# EAGLE schematic untitled (EAGLE 6.6.0)

## Sheet 1 of 2
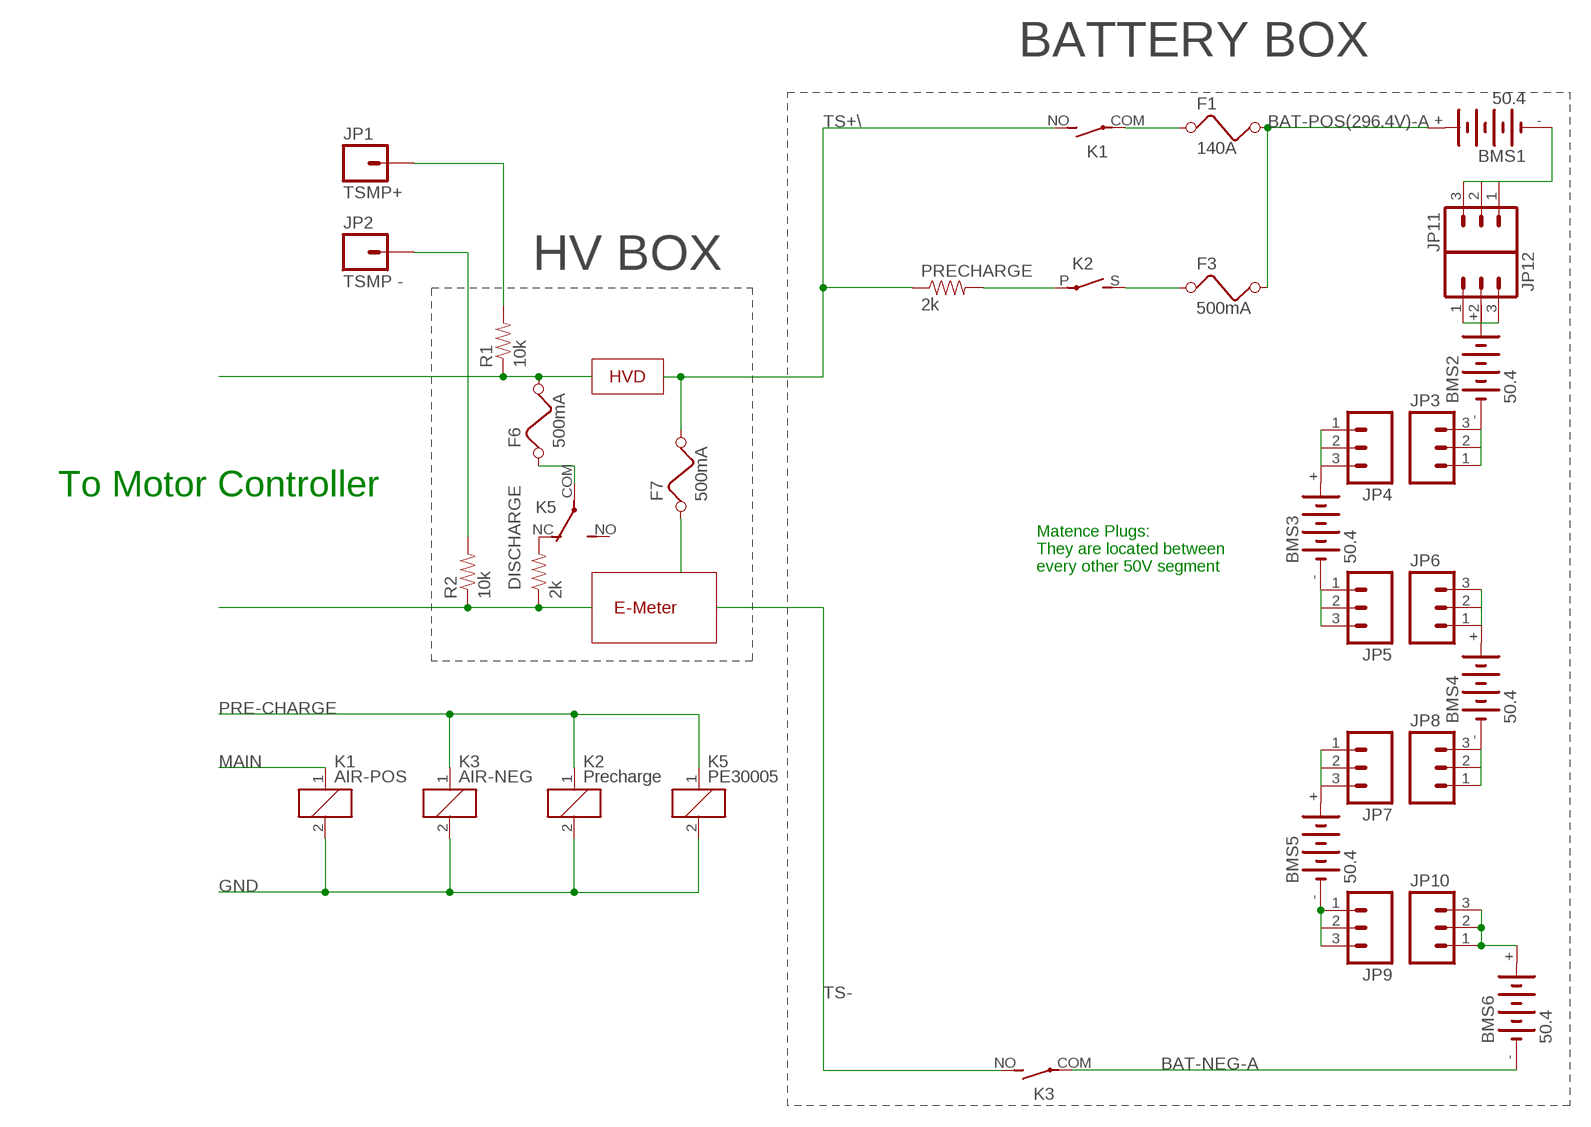
[diagram p0: schematic, sheet 1]

### Parts
BMS1  50.4  VST4V8  [VST4]
BMS2  50.4  VST4V8  [VST4]
BMS3  50.4  VST4V8  [VST4]
BMS4  50.4  VST4V8  [VST4]
BMS5  50.4  VST4V8  [VST4]
BMS6  50.4  VST4V8  [VST4]
DISCHARGE  2k  2.0KOHM1/10W5%(0603)  [0603-RES]
F1  140A  FUSE  [FUSE]
F3  500mA  FUSE  [FUSE]
F6  500mA  FUSE  [FUSE]
F7  500mA  FUSE  [FUSE]
JP1  TSMP+  M01-SMTSO-256-ET  [SMTSO-256-ET]
JP2  TSMP -  M01-SMTSO-256-ET  [SMTSO-256-ET]
JP3  M03JST-PTH  [JST-3-PTH]
JP4  M03JST-PTH  [JST-3-PTH]
JP5  M03JST-PTH  [JST-3-PTH]
JP6  M03JST-PTH  [JST-3-PTH]
JP7  M03JST-PTH  [JST-3-PTH]
JP8  M03JST-PTH  [JST-3-PTH]
JP9  M03JST-PTH  [JST-3-PTH]
JP10  M03JST-PTH  [JST-3-PTH]
JP11  M03JST-PTH  [JST-3-PTH]
JP12  M03JST-PTH  [JST-3-PTH]
K1  AIR-POS  APF30212A  [APF30212A]
K2  Precharge  G2RA  [G2RA]
K3  AIR-NEG  APF30212A  [APF30212A]
K5  PE30005  [PE-FORM-C]
PRECHARGE  2k  2.0KOHM1/10W5%(0603)  [0603-RES]
R1  10k  RESISTOR0805-RES  [0805]
R2  10k  RESISTOR0805-RES  [0805]

### Nets
BAT-NEG-A: BMS6.- K3.COM(2:P)
BAT-POS(296.4V)-A: BMS1.+ F1.2 F3.2
GND: K1.2 K2.2 K3.2 K5.2
MAIN: K1.1
N$1: BMS5.- JP9.1 JP9.2 JP9.3
N$2: BMS6.+ JP10.1 JP10.2 JP10.3
N$3: BMS5.+ JP7.1 JP7.2 JP7.3
N$4: BMS4.- JP8.1 JP8.2 JP8.3
N$5: BMS4.+ JP6.1 JP6.2 JP6.3
N$6: F3.1 K2.S(2:S)
N$7: JP1.P$1 R1.2
N$8: DISCHARGE.2 K5.NC(2:O)
N$9: K2.P(2:P) PRECHARGE.2
N$10: F6.1 K5.COM(2:P)
N$14: F6.2 R1.1
N$15: BMS3.- JP5.1 JP5.2 JP5.3
N$16: JP2.P$1 R2.2
N$17: F7.1
N$19: F1.1 K1.COM(2:P)
N$20: BMS3.+ JP4.1 JP4.2 JP4.3
N$21: BMS2.- JP3.1 JP3.2 JP3.3
N$30: BMS2.+@1(+) JP12.1 JP12.2 JP12.3
N$31: BMS1.- JP11.1 JP11.2 JP11.3
N$113: DISCHARGE.1 R2.1
PRE-CHARGE: K2.1 K3.1 K5.1
TS+\: F7.2 K1.NO(2:S) PRECHARGE.1
TS-: K3.NO(2:S)
Unconnected: BMS1.+@1(+) BMS2.+ BMS3.+@1(+) BMS4.+@1(+) BMS5.+@1(+) BMS6.+@1(+) K5.NO(2:S)

### Notes on the sheet
- BATTERY BOX
- HV BOX
- HVD
- To Motor Controller
- Matence Plugs:
  They are located between
  every other 50V segment
- E-Meter

## Sheet 2 of 2
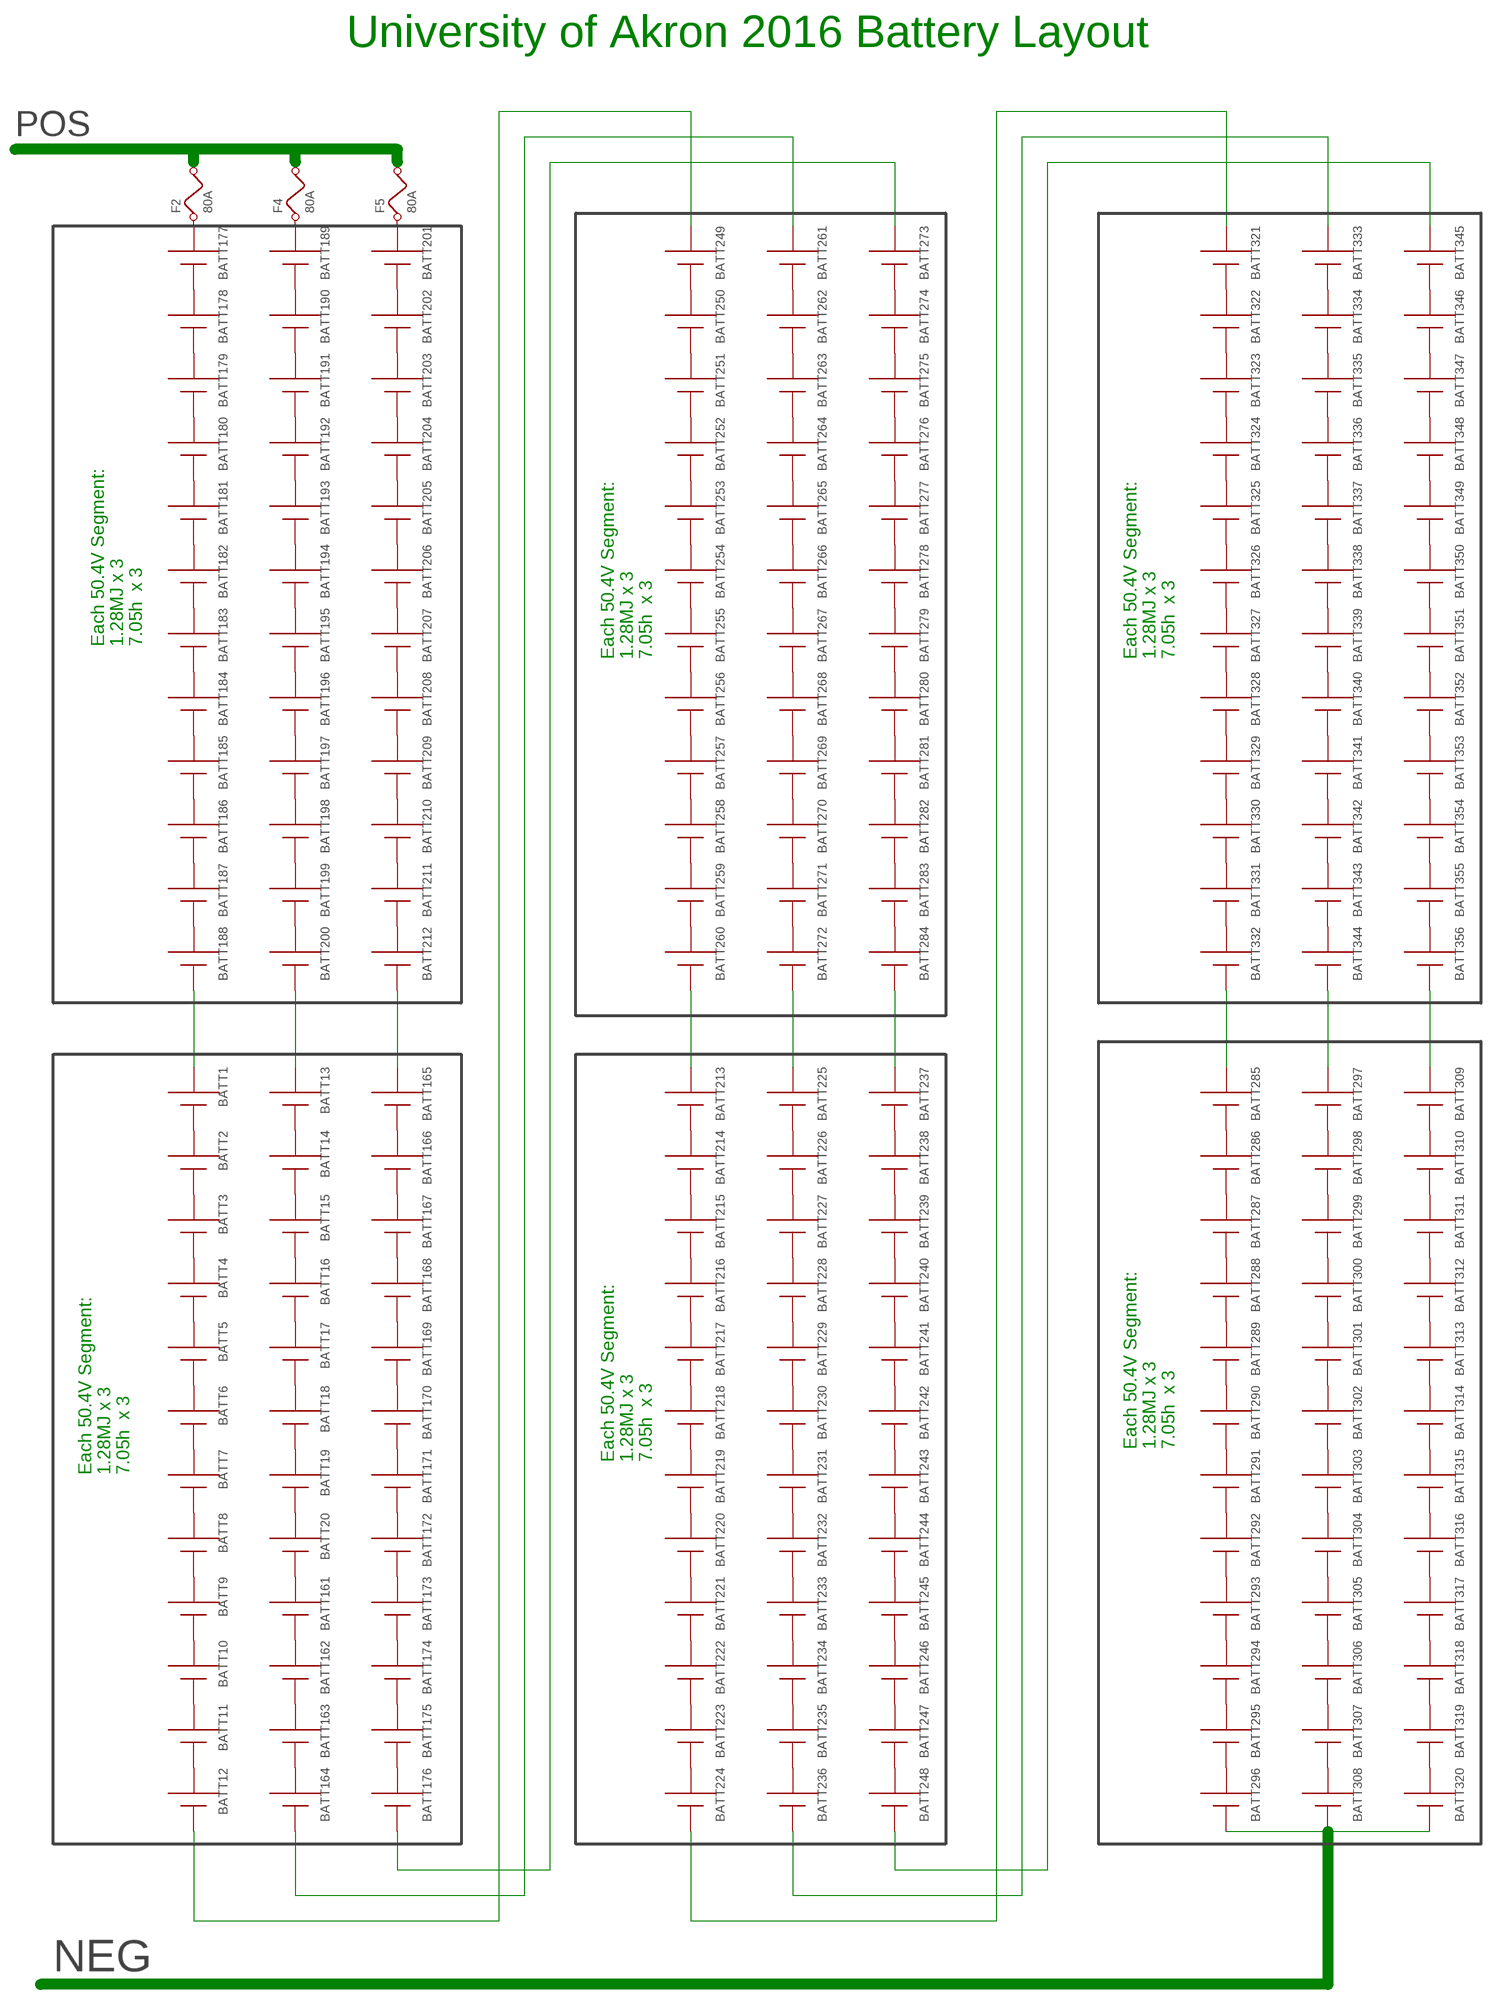
[diagram p1: schematic, sheet 2]

### Parts
BATT1  AAA  [12BH412]
BATT2  AAA  [12BH412]
BATT3  AAA  [12BH412]
BATT4  AAA  [12BH412]
BATT5  AAA  [12BH412]
BATT6  AAA  [12BH412]
BATT7  AAA  [12BH412]
BATT8  AAA  [12BH412]
BATT9  AAA  [12BH412]
BATT10  AAA  [12BH412]
BATT11  AAA  [12BH412]
BATT12  AAA  [12BH412]
BATT13  AAA  [12BH412]
BATT14  AAA  [12BH412]
BATT15  AAA  [12BH412]
BATT16  AAA  [12BH412]
BATT17  AAA  [12BH412]
BATT18  AAA  [12BH412]
BATT19  AAA  [12BH412]
BATT20  AAA  [12BH412]
BATT161  AAA  [12BH412]
BATT162  AAA  [12BH412]
BATT163  AAA  [12BH412]
BATT164  AAA  [12BH412]
BATT165  AAA  [12BH412]
BATT166  AAA  [12BH412]
BATT167  AAA  [12BH412]
BATT168  AAA  [12BH412]
BATT169  AAA  [12BH412]
BATT170  AAA  [12BH412]
BATT171  AAA  [12BH412]
BATT172  AAA  [12BH412]
BATT173  AAA  [12BH412]
BATT174  AAA  [12BH412]
BATT175  AAA  [12BH412]
BATT176  AAA  [12BH412]
BATT177  AAA  [12BH412]
BATT178  AAA  [12BH412]
BATT179  AAA  [12BH412]
BATT180  AAA  [12BH412]
BATT181  AAA  [12BH412]
BATT182  AAA  [12BH412]
BATT183  AAA  [12BH412]
BATT184  AAA  [12BH412]
BATT185  AAA  [12BH412]
BATT186  AAA  [12BH412]
BATT187  AAA  [12BH412]
BATT188  AAA  [12BH412]
BATT189  AAA  [12BH412]
BATT190  AAA  [12BH412]
BATT191  AAA  [12BH412]
BATT192  AAA  [12BH412]
BATT193  AAA  [12BH412]
BATT194  AAA  [12BH412]
BATT195  AAA  [12BH412]
BATT196  AAA  [12BH412]
BATT197  AAA  [12BH412]
BATT198  AAA  [12BH412]
BATT199  AAA  [12BH412]
BATT200  AAA  [12BH412]
BATT201  AAA  [12BH412]
BATT202  AAA  [12BH412]
BATT203  AAA  [12BH412]
BATT204  AAA  [12BH412]
BATT205  AAA  [12BH412]
BATT206  AAA  [12BH412]
BATT207  AAA  [12BH412]
BATT208  AAA  [12BH412]
BATT209  AAA  [12BH412]
BATT210  AAA  [12BH412]
BATT211  AAA  [12BH412]
BATT212  AAA  [12BH412]
BATT213  AAA  [12BH412]
BATT214  AAA  [12BH412]
BATT215  AAA  [12BH412]
BATT216  AAA  [12BH412]
BATT217  AAA  [12BH412]
BATT218  AAA  [12BH412]
BATT219  AAA  [12BH412]
BATT220  AAA  [12BH412]
BATT221  AAA  [12BH412]
BATT222  AAA  [12BH412]
BATT223  AAA  [12BH412]
BATT224  AAA  [12BH412]
BATT225  AAA  [12BH412]
BATT226  AAA  [12BH412]
BATT227  AAA  [12BH412]
BATT228  AAA  [12BH412]
BATT229  AAA  [12BH412]
BATT230  AAA  [12BH412]
BATT231  AAA  [12BH412]
BATT232  AAA  [12BH412]
BATT233  AAA  [12BH412]
BATT234  AAA  [12BH412]
BATT235  AAA  [12BH412]
BATT236  AAA  [12BH412]
BATT237  AAA  [12BH412]
BATT238  AAA  [12BH412]
BATT239  AAA  [12BH412]
BATT240  AAA  [12BH412]
BATT241  AAA  [12BH412]
BATT242  AAA  [12BH412]
BATT243  AAA  [12BH412]
BATT244  AAA  [12BH412]
BATT245  AAA  [12BH412]
BATT246  AAA  [12BH412]
BATT247  AAA  [12BH412]
BATT248  AAA  [12BH412]
BATT249  AAA  [12BH412]
BATT250  AAA  [12BH412]
BATT251  AAA  [12BH412]
BATT252  AAA  [12BH412]
BATT253  AAA  [12BH412]
BATT254  AAA  [12BH412]
BATT255  AAA  [12BH412]
BATT256  AAA  [12BH412]
BATT257  AAA  [12BH412]
BATT258  AAA  [12BH412]
BATT259  AAA  [12BH412]
BATT260  AAA  [12BH412]
BATT261  AAA  [12BH412]
BATT262  AAA  [12BH412]
BATT263  AAA  [12BH412]
BATT264  AAA  [12BH412]
BATT265  AAA  [12BH412]
BATT266  AAA  [12BH412]
BATT267  AAA  [12BH412]
BATT268  AAA  [12BH412]
BATT269  AAA  [12BH412]
BATT270  AAA  [12BH412]
BATT271  AAA  [12BH412]
BATT272  AAA  [12BH412]
BATT273  AAA  [12BH412]
BATT274  AAA  [12BH412]
BATT275  AAA  [12BH412]
BATT276  AAA  [12BH412]
BATT277  AAA  [12BH412]
BATT278  AAA  [12BH412]
BATT279  AAA  [12BH412]
BATT280  AAA  [12BH412]
BATT281  AAA  [12BH412]
BATT282  AAA  [12BH412]
BATT283  AAA  [12BH412]
BATT284  AAA  [12BH412]
BATT285  AAA  [12BH412]
BATT286  AAA  [12BH412]
BATT287  AAA  [12BH412]
BATT288  AAA  [12BH412]
BATT289  AAA  [12BH412]
BATT290  AAA  [12BH412]
BATT291  AAA  [12BH412]
BATT292  AAA  [12BH412]
BATT293  AAA  [12BH412]
BATT294  AAA  [12BH412]
BATT295  AAA  [12BH412]
BATT296  AAA  [12BH412]
BATT297  AAA  [12BH412]
BATT298  AAA  [12BH412]
BATT299  AAA  [12BH412]
BATT300  AAA  [12BH412]
BATT301  AAA  [12BH412]
BATT302  AAA  [12BH412]
BATT303  AAA  [12BH412]
BATT304  AAA  [12BH412]
BATT305  AAA  [12BH412]
BATT306  AAA  [12BH412]
BATT307  AAA  [12BH412]
BATT308  AAA  [12BH412]
BATT309  AAA  [12BH412]
BATT310  AAA  [12BH412]
BATT311  AAA  [12BH412]
BATT312  AAA  [12BH412]
BATT313  AAA  [12BH412]
BATT314  AAA  [12BH412]
BATT315  AAA  [12BH412]
BATT316  AAA  [12BH412]
BATT317  AAA  [12BH412]
BATT318  AAA  [12BH412]
BATT319  AAA  [12BH412]
BATT320  AAA  [12BH412]
BATT321  AAA  [12BH412]
BATT322  AAA  [12BH412]
BATT323  AAA  [12BH412]
BATT324  AAA  [12BH412]
BATT325  AAA  [12BH412]
BATT326  AAA  [12BH412]
BATT327  AAA  [12BH412]
BATT328  AAA  [12BH412]
BATT329  AAA  [12BH412]
BATT330  AAA  [12BH412]
BATT331  AAA  [12BH412]
BATT332  AAA  [12BH412]
BATT333  AAA  [12BH412]
BATT334  AAA  [12BH412]
BATT335  AAA  [12BH412]
BATT336  AAA  [12BH412]
BATT337  AAA  [12BH412]
BATT338  AAA  [12BH412]
BATT339  AAA  [12BH412]
BATT340  AAA  [12BH412]
BATT341  AAA  [12BH412]
BATT342  AAA  [12BH412]
BATT343  AAA  [12BH412]
BATT344  AAA  [12BH412]
BATT345  AAA  [12BH412]
BATT346  AAA  [12BH412]
BATT347  AAA  [12BH412]
BATT348  AAA  [12BH412]
BATT349  AAA  [12BH412]
BATT350  AAA  [12BH412]
BATT351  AAA  [12BH412]
BATT352  AAA  [12BH412]
BATT353  AAA  [12BH412]
BATT354  AAA  [12BH412]
BATT355  AAA  [12BH412]
BATT356  AAA  [12BH412]
F2  80A  FUSE  [FUSE]
F4  80A  FUSE  [FUSE]
F5  80A  FUSE  [FUSE]

### Nets
N$11: BATT177.- F2.1
N$12: BATT189.- F4.1
N$13: BATT201.- F5.1
N$18: BATT177.+ BATT178.-
N$22: BATT1.+ BATT2.-
N$23: BATT2.+ BATT3.-
N$24: BATT5.+ BATT6.-
N$25: BATT4.+ BATT5.-
N$26: BATT10.+ BATT11.-
N$27: BATT7.+ BATT8.-
N$28: BATT8.+ BATT9.-
N$29: BATT9.+ BATT10.-
N$38: BATT3.+ BATT4.-
N$39: BATT11.+ BATT12.-
N$40: BATT6.+ BATT7.-
N$115: BATT13.+ BATT14.-
N$116: BATT14.+ BATT15.-
N$117: BATT16.+ BATT17.-
N$118: BATT19.+ BATT20.-
N$119: BATT20.+ BATT161.-
N$120: BATT161.+ BATT162.-
N$121: BATT15.+ BATT16.-
N$122: BATT17.+ BATT18.-
N$123: BATT18.+ BATT19.-
N$124: BATT162.+ BATT163.-
N$125: BATT163.+ BATT164.-
N$126: BATT165.+ BATT166.-
N$127: BATT166.+ BATT167.-
N$128: BATT168.+ BATT169.-
N$129: BATT171.+ BATT172.-
N$130: BATT172.+ BATT173.-
N$131: BATT173.+ BATT174.-
N$132: BATT167.+ BATT168.-
N$133: BATT169.+ BATT170.-
N$134: BATT170.+ BATT171.-
N$135: BATT174.+ BATT175.-
N$136: BATT175.+ BATT176.-
N$137: BATT178.+ BATT179.-
N$138: BATT180.+ BATT181.-
N$139: BATT183.+ BATT184.-
N$140: BATT184.+ BATT185.-
N$141: BATT185.+ BATT186.-
N$142: BATT179.+ BATT180.-
N$143: BATT181.+ BATT182.-
N$144: BATT182.+ BATT183.-
N$145: BATT186.+ BATT187.-
N$146: BATT187.+ BATT188.-
N$147: BATT189.+ BATT190.-
N$148: BATT190.+ BATT191.-
N$149: BATT192.+ BATT193.-
N$150: BATT195.+ BATT196.-
N$151: BATT196.+ BATT197.-
N$152: BATT197.+ BATT198.-
N$153: BATT191.+ BATT192.-
N$154: BATT193.+ BATT194.-
N$155: BATT194.+ BATT195.-
N$156: BATT198.+ BATT199.-
N$157: BATT199.+ BATT200.-
N$158: BATT201.+ BATT202.-
N$159: BATT202.+ BATT203.-
N$160: BATT204.+ BATT205.-
N$161: BATT207.+ BATT208.-
N$162: BATT208.+ BATT209.-
N$163: BATT209.+ BATT210.-
N$164: BATT203.+ BATT204.-
N$165: BATT205.+ BATT206.-
N$166: BATT206.+ BATT207.-
N$167: BATT210.+ BATT211.-
N$168: BATT211.+ BATT212.-
N$169: BATT213.+ BATT214.-
N$170: BATT214.+ BATT215.-
N$171: BATT216.+ BATT217.-
N$172: BATT219.+ BATT220.-
N$173: BATT220.+ BATT221.-
N$174: BATT221.+ BATT222.-
N$175: BATT215.+ BATT216.-
N$176: BATT217.+ BATT218.-
N$177: BATT218.+ BATT219.-
N$178: BATT222.+ BATT223.-
N$179: BATT223.+ BATT224.-
N$180: BATT225.+ BATT226.-
N$181: BATT226.+ BATT227.-
N$182: BATT228.+ BATT229.-
N$183: BATT231.+ BATT232.-
N$184: BATT232.+ BATT233.-
N$185: BATT233.+ BATT234.-
N$186: BATT227.+ BATT228.-
N$187: BATT229.+ BATT230.-
N$188: BATT230.+ BATT231.-
N$189: BATT234.+ BATT235.-
N$190: BATT235.+ BATT236.-
N$191: BATT237.+ BATT238.-
N$192: BATT238.+ BATT239.-
N$193: BATT240.+ BATT241.-
N$194: BATT243.+ BATT244.-
N$195: BATT244.+ BATT245.-
N$196: BATT245.+ BATT246.-
N$197: BATT239.+ BATT240.-
N$198: BATT241.+ BATT242.-
N$199: BATT242.+ BATT243.-
N$200: BATT246.+ BATT247.-
N$201: BATT247.+ BATT248.-
N$202: BATT249.+ BATT250.-
N$203: BATT250.+ BATT251.-
N$204: BATT252.+ BATT253.-
N$205: BATT255.+ BATT256.-
N$206: BATT256.+ BATT257.-
N$207: BATT257.+ BATT258.-
N$208: BATT251.+ BATT252.-
N$209: BATT253.+ BATT254.-
N$210: BATT254.+ BATT255.-
N$211: BATT258.+ BATT259.-
N$212: BATT259.+ BATT260.-
N$213: BATT261.+ BATT262.-
N$214: BATT262.+ BATT263.-
N$215: BATT264.+ BATT265.-
N$216: BATT267.+ BATT268.-
N$217: BATT268.+ BATT269.-
N$218: BATT269.+ BATT270.-
N$219: BATT263.+ BATT264.-
N$220: BATT265.+ BATT266.-
N$221: BATT266.+ BATT267.-
N$222: BATT270.+ BATT271.-
N$223: BATT271.+ BATT272.-
N$224: BATT273.+ BATT274.-
N$225: BATT274.+ BATT275.-
N$226: BATT276.+ BATT277.-
N$227: BATT279.+ BATT280.-
N$228: BATT280.+ BATT281.-
N$229: BATT281.+ BATT282.-
N$230: BATT275.+ BATT276.-
N$231: BATT277.+ BATT278.-
N$232: BATT278.+ BATT279.-
N$233: BATT282.+ BATT283.-
N$234: BATT283.+ BATT284.-
N$235: BATT285.+ BATT286.-
N$236: BATT286.+ BATT287.-
N$237: BATT288.+ BATT289.-
N$238: BATT291.+ BATT292.-
N$239: BATT292.+ BATT293.-
N$240: BATT293.+ BATT294.-
N$241: BATT287.+ BATT288.-
N$242: BATT289.+ BATT290.-
N$243: BATT290.+ BATT291.-
N$244: BATT294.+ BATT295.-
N$245: BATT295.+ BATT296.-
N$246: BATT297.+ BATT298.-
N$247: BATT298.+ BATT299.-
N$248: BATT300.+ BATT301.-
N$249: BATT303.+ BATT304.-
N$250: BATT304.+ BATT305.-
N$251: BATT305.+ BATT306.-
N$252: BATT299.+ BATT300.-
N$253: BATT301.+ BATT302.-
N$254: BATT302.+ BATT303.-
N$255: BATT306.+ BATT307.-
N$256: BATT307.+ BATT308.-
N$257: BATT309.+ BATT310.-
N$258: BATT310.+ BATT311.-
N$259: BATT312.+ BATT313.-
N$260: BATT315.+ BATT316.-
N$261: BATT316.+ BATT317.-
N$262: BATT317.+ BATT318.-
N$263: BATT311.+ BATT312.-
N$264: BATT313.+ BATT314.-
N$265: BATT314.+ BATT315.-
N$266: BATT318.+ BATT319.-
N$267: BATT319.+ BATT320.-
N$268: BATT321.+ BATT322.-
N$269: BATT322.+ BATT323.-
N$270: BATT324.+ BATT325.-
N$271: BATT327.+ BATT328.-
N$272: BATT328.+ BATT329.-
N$273: BATT329.+ BATT330.-
N$274: BATT323.+ BATT324.-
N$275: BATT325.+ BATT326.-
N$276: BATT326.+ BATT327.-
N$277: BATT330.+ BATT331.-
N$278: BATT331.+ BATT332.-
N$279: BATT333.+ BATT334.-
N$280: BATT334.+ BATT335.-
N$281: BATT336.+ BATT337.-
N$282: BATT339.+ BATT340.-
N$283: BATT340.+ BATT341.-
N$284: BATT341.+ BATT342.-
N$285: BATT335.+ BATT336.-
N$286: BATT337.+ BATT338.-
N$287: BATT338.+ BATT339.-
N$288: BATT342.+ BATT343.-
N$289: BATT343.+ BATT344.-
N$290: BATT345.+ BATT346.-
N$291: BATT346.+ BATT347.-
N$292: BATT348.+ BATT349.-
N$293: BATT351.+ BATT352.-
N$294: BATT352.+ BATT353.-
N$295: BATT353.+ BATT354.-
N$296: BATT347.+ BATT348.-
N$297: BATT349.+ BATT350.-
N$298: BATT350.+ BATT351.-
N$299: BATT354.+ BATT355.-
N$300: BATT355.+ BATT356.-
N$301: BATT1.- BATT188.+
N$302: BATT13.- BATT200.+
N$303: BATT165.- BATT212.+
N$304: BATT176.+ BATT273.-
N$305: BATT164.+ BATT261.-
N$306: BATT12.+ BATT249.-
N$307: BATT213.- BATT260.+
N$308: BATT225.- BATT272.+
N$309: BATT237.- BATT284.+
N$310: BATT285.- BATT332.+
N$311: BATT297.- BATT344.+
N$312: BATT309.- BATT356.+
N$313: BATT224.+ BATT321.-
N$314: BATT236.+ BATT333.-
N$315: BATT248.+ BATT345.-
NEG: BATT296.+ BATT308.+ BATT320.+
POS: F2.2 F4.2 F5.2

### Notes on the sheet
- University of Akron 2016 Battery Layout
- Each 50.4V Segment:
  1.28MJ x 3
  7.05h  x 3
- Each 50.4V Segment:
  1.28MJ x 3
  7.05h  x 3
- Each 50.4V Segment:
  1.28MJ x 3
  7.05h  x 3
- Each 50.4V Segment:
  1.28MJ x 3
  7.05h  x 3
- Each 50.4V Segment:
  1.28MJ x 3
  7.05h  x 3
- Each 50.4V Segment:
  1.28MJ x 3
  7.05h  x 3

## Library data of the parts
BATT1-BATT20 BATT161-BATT356 = adafruit:AAA: AAA PC pin holder Mouser part #12BH412 - but pretty much any 1x AAA battery holder should be the same http://www.ladyada.net/library/pcb/eaglelibrary.html
BMS1-BMS6 = battery:VST4V8: NC ACCU Varta Safe Tronic 4V8
DISCHARGE PRECHARGE = SparkFun-Resistors:2.0KOHM1/10W5%(0603): RES-08296; PROD_ID: RES-08296; VALUE: 2.0k
F1-F7 = special:FUSE: FUSE 5 x 20 mm
JP1 JP2 = SparkFun-Connectors:M01: Header 1 Standard 1-pin 0.1" header. Use with straight break away headers (SKU : PRT-00116), right angle break away headers (PRT-00553), swiss pins (PRT-00743), machine pins (PRT-00117), and female headers (PRT-00115).
JP3-JP12 = SparkFun-Connectors:M03: Header 3 Standard 3-pin 0.1" header. Use with straight break away headers (SKU : PRT-00116), right angle break away headers (PRT-00553), swiss pins (PRT-00743), machine pins (PRT-00117), and female headers (PRT-00115). Molex polarized connector foot print use with SKU : PRT-08232 with associated crimp pins and housings.; SKU: PRT-09915
K1 K3 = relay:APF30212A: Compliant with European standards 1a/1c 6A Slim power relays Source: Data sheet <http://pewa.panasonic.com/assets/pcsd/catalog/pf-catalog.pdf>; OC_FARNELL: unknown
K2 = relay:G2RA: RELAY 1 x norm. open, Omron; OC_FARNELL: unknown; OC_NEWARK: unknown
K5 = relay:PE30?*: SLIM POWER Relay NAiS Source: http://www.mew-europe.com/.. en_ds_61122_0000.pdf; OC_FARNELL: unknown; OC_NEWARK: unknown
R1 R2 = SparkFun-Passives:RESISTOR: Resistor Basic schematic elements and footprints for 0603, 1206, and PTH resistors.